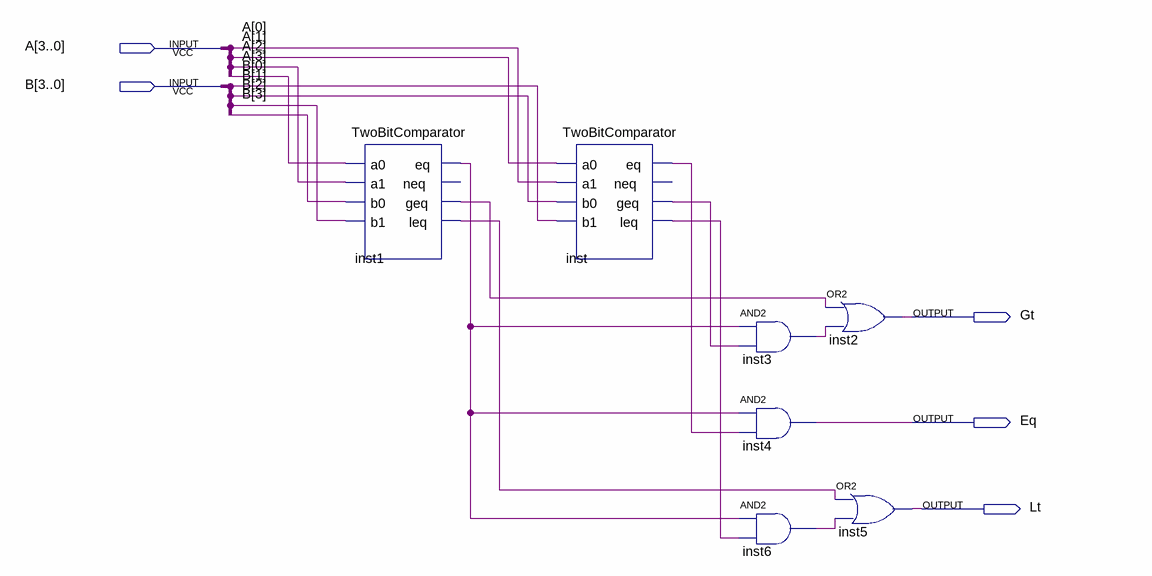
[diagram p0: schematic sheet]
// Quartus schematic FourBitComparator.bdf as structural Verilog: 7 symbols, 5 pins
module FourBitComparator (
  input  [3:0] A,
  input  [3:0] B,
  output Gt,
  output Eq,
  output Lt
);

  wire inst1_eq, inst1_geq, inst1_leq, inst3_out, inst6_out, inst_eq, inst_geq, inst_leq;

  TwoBitComparator inst1 (
    .a0(A[3]), .a1(A[2]), .b0(B[3]), .b1(B[2]), .eq(inst1_eq), .geq(inst1_geq), .leq(inst1_leq));  // open: neq
  TwoBitComparator inst (
    .a0(A[1]), .a1(A[0]), .b0(B[1]), .b1(B[0]), .eq(inst_eq), .geq(inst_geq), .leq(inst_leq));  // open: neq
  and inst3 (inst3_out, inst1_eq, inst_geq);
  and inst4 (Eq, inst1_eq, inst_eq);
  and inst6 (inst6_out, inst1_eq, inst_leq);
  or inst2 (Gt, inst1_geq, inst3_out);
  or inst5 (Lt, inst1_leq, inst6_out);
endmodule
